# Altium schematic sheet power.SchDoc
size A4
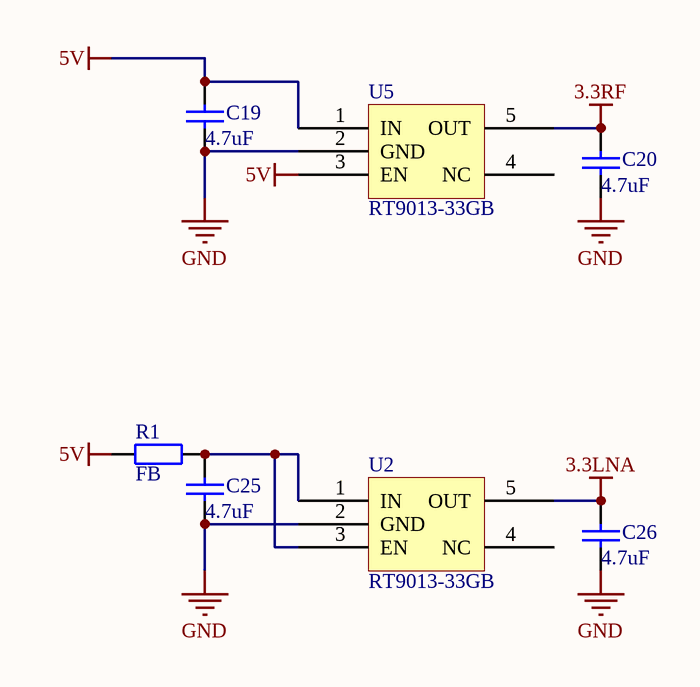
[diagram p0: power.SchDoc]

## Parts
C19  4.7uF  [0603]
C20  4.7uF  [0603]
C25  4.7uF  [0603]
C26  4.7uF  [0603]
R1  FB  [0402]
U2  RT9013-33GB  [SOT23-5]
U5  RT9013-33GB  [SOT23-5]

## Nets
3.3LNA: C26.2 U2.5(OUT)
3.3RF: C20.2 U5.5(OUT)
5V: C19.2 R1.2 U5.1(IN) U5.3(EN)
GND: C19.1 C20.1 C25.1 C26.1 U2.2(GND) U5.2(GND)
NetC25_2: C25.2 R1.1 U2.1(IN) U2.3(EN)

Not connected (* = marked no-connect by the designer): U2 4(NC); U5 4(NC)

## Library data of the parts
C19 C20 C25 C26 = Cap: Capacitor; Published: 8-Jun-2000; LatestRevisionDate: 17-Jul-2002; LatestRevisionNote: Re-released for DXP Platform.; PackageReference: RAD-0.3; Publisher: Altium Limited; PackageDescription: Radial Cap, Thru-Hole; 2 Leads; 0.3 in Pin Spacing
R1 = Res2: Resistor; Published: 8-Jun-2000; LatestRevisionDate: 17-Jul-2002; LatestRevisionNote: Re-released for DXP Platform.; PackageReference: AXIAL-0.4; Publisher: Altium Limited; PackageDescription: Axial Device, Thru-Hole; 2 Leads; 0.4 in Pin Spacing
U2 U5 = LP5907